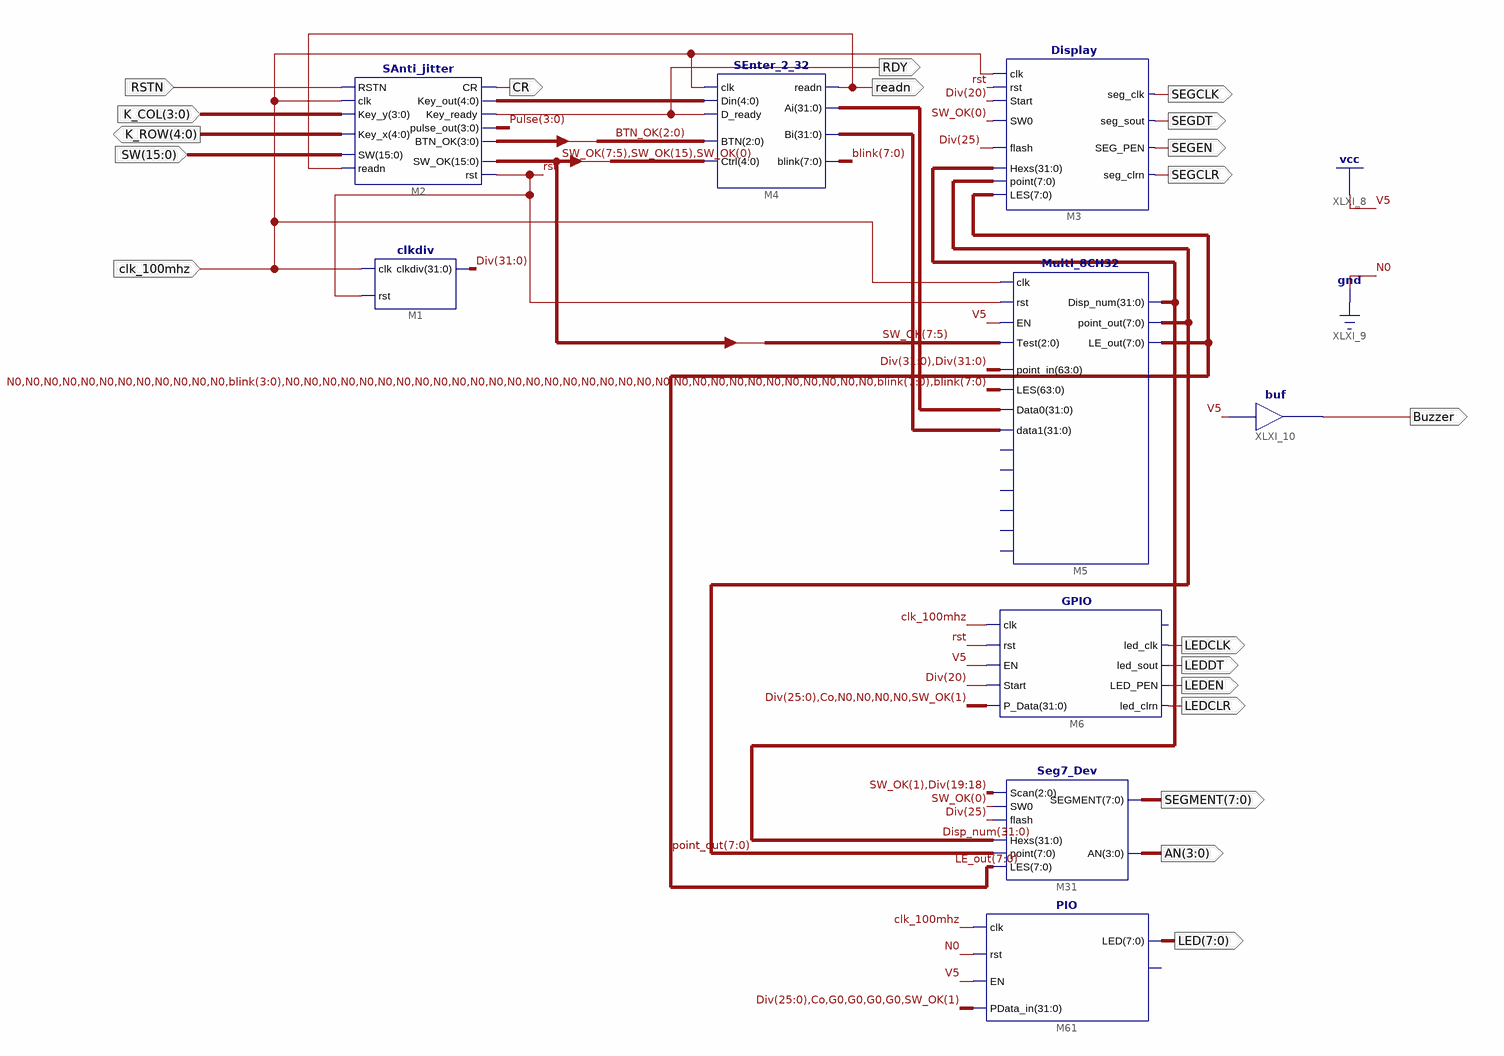
[diagram p0: schematic sheet 1]
// Xilinx ISE schematic Top.sch (kintex7) as structural Verilog: 9 symbols, 20 ports
module Top (
  input  [3:0] K_COL,
  input  [15:0] SW,
  input  RSTN,
  input  clk_100mhz,
  output [4:0] K_ROW,
  output CR,
  output RDY,
  output readn,
  output SEGCLK,
  output SEGDT,
  output SEGEN,
  output SEGCLR,
  output Buzzer,
  output LEDCLK,
  output LEDDT,
  output LEDEN,
  output LEDCLR,
  output [7:0] SEGMENT,
  output [3:0] AN,
  output [7:0] LED
);

  wire Co, G0, rst;
  wire [3:0] BTN_OK, Pulse;
  wire [4:0] XLXN_9;
  wire [7:0] blink, LE_out, point_out;
  wire [15:0] SW_OK;
  wire [31:0] Disp_num, Div, XLXN_20, XLXN_21;

  SAnti_jitter M2 (
    .SW(SW), .readn(readn), .Key_y(K_COL), .Key_x(K_ROW), .RSTN(RSTN), .clk(clk_100mhz), .Key_out(XLXN_9),
    .Key_ready(RDY), .CR(CR), .rst(rst), .SW_OK(SW_OK), .pulse_out(Pulse), .BTN_OK(BTN_OK));
  SEnter_2_32 M4 (
    .readn(readn), .Ai(XLXN_20), .Bi(XLXN_21), .blink(blink), .Din(XLXN_9), .D_ready(RDY), .clk(clk_100mhz),
    .Ctrl({SW_OK[7:5], SW_OK[15], SW_OK[0]}), .BTN(BTN_OK[2:0]));
  Display M3 (
    .LES(LE_out), .SEG_PEN(SEGEN), .seg_sout(SEGDT), .seg_clrn(SEGCLR), .point(point_out), .Hexs(Disp_num),
    .SW0(SW_OK[0]), .flash(Div[25]), .seg_clk(SEGCLK), .clk(clk_100mhz), .rst(rst), .Start(Div[20]));
  Multi_8CH32 M5 (
    .Test(SW_OK[7:5]), .point_in({Div, Div}), .EN(1'b1), .clk(clk_100mhz), .rst(rst),
    .LES({{12{1'b0}}, blink[3:0], {32{1'b0}}, blink, blink}), .Data0(XLXN_20), .data1(XLXN_21),
    .point_out(point_out), .LE_out(LE_out), .Disp_num(Disp_num));  // open: data2, data3, data4, data5, data6, data7
  clkdiv M1 (.clkdiv(Div), .clk(clk_100mhz), .rst(rst));
  buf XLXI_10 (Buzzer, 1'b1);
  GPIO M6 (
    .clk(clk_100mhz), .P_Data({Div[25:0], Co, 4'b0000, SW_OK[1]}), .rst(rst), .EN(1'b1), .Start(Div[20]),
    .led_clrn(LEDCLR), .led_clk(LEDCLK), .led_sout(LEDDT), .LED_PEN(LEDEN));  // open: GPIOf0
  Seg7_Dev M31 (
    .LES(LE_out), .Scan({SW_OK[1], Div[19:18]}), .SEGMENT(SEGMENT), .AN(AN), .point(point_out),
    .flash(Div[25]), .SW0(SW_OK[0]), .Hexs(Disp_num));
  PIO M61 (
    .clk(clk_100mhz), .rst(1'b0), .EN(1'b1), .PData_in({Div[25:0], Co, {4{G0}}, SW_OK[1]}), .LED(LED));  // open: GPIOf0
endmodule
